# Altium schematic sheet Connectors.SchDoc
size B; DrawnBy: Ross Harvey; Revision: A; SheetNumber: 4; ModifiedDate: 7/2/2015; ProjectName: Atlas
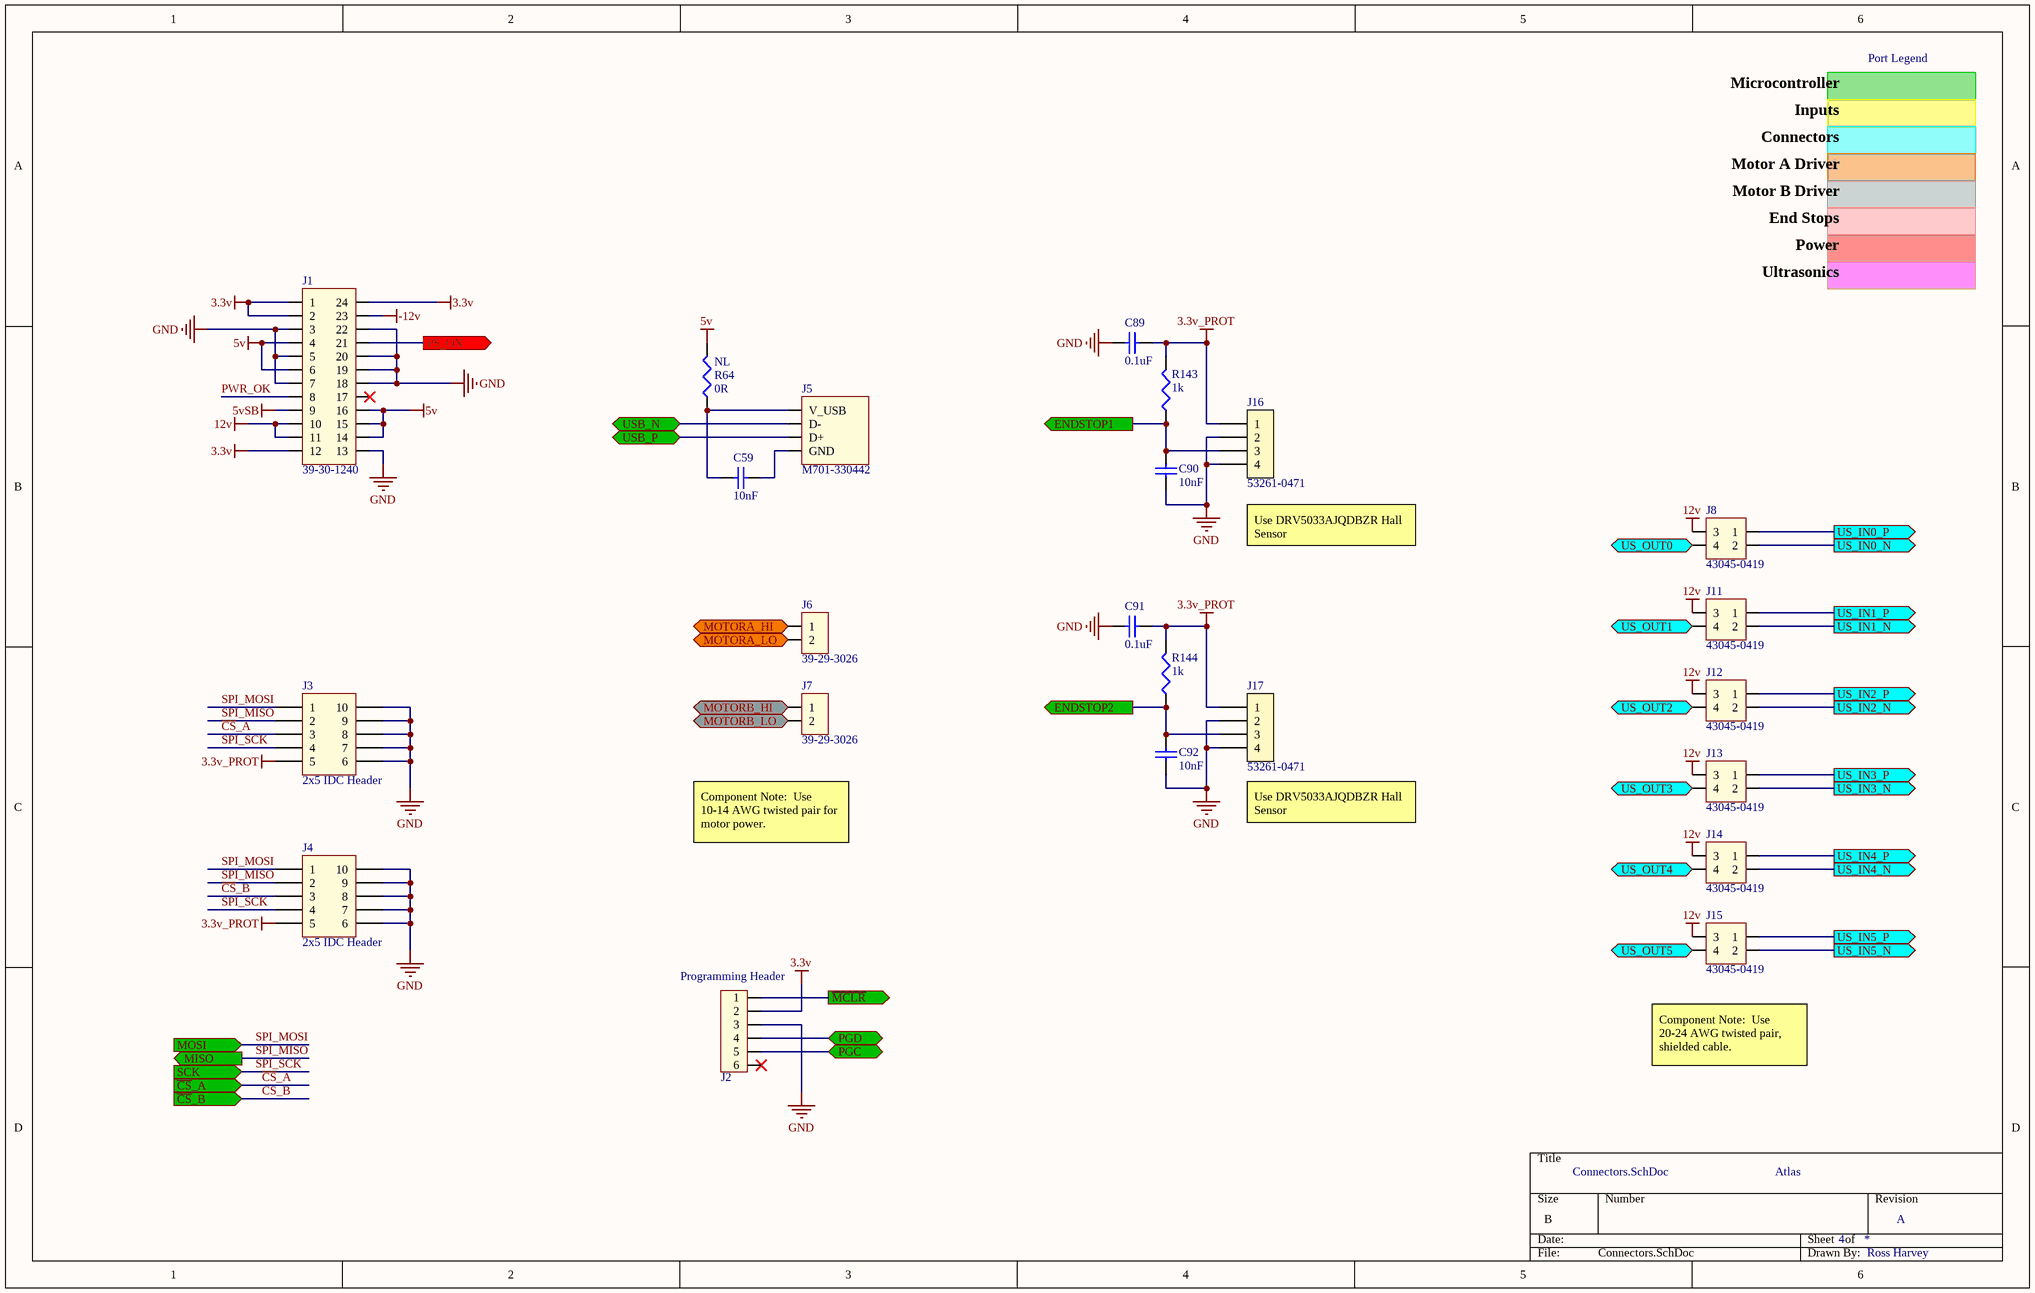
[diagram p0: Connectors.SchDoc]

## Parts
C59  10nF  [CAP0603W]
C89  0.1uF  [CAP0603W]
C90  10nF  [CAP0603W]
C91  0.1uF  [CAP0603W]
C92  10nF  [CAP0603W]
J1  39-30-1240  [MOLEX 39-30-1240]
J2  1x6 Header  [1x6 Header]  (value not drawn)
J3  87831-1010  [MOLEX_87831-1010]  (value not drawn)
J4  87831-1010  [MOLEX_87831-1010]  (value not drawn)
J5  M701-330442  [M701-330442]
J6  39-29-3026  [1x2 MicroFit]
J7  39-29-3026  [1x2 MicroFit]
J8  43045-0419  [MicroFit 2x2]
J11  43045-0419  [MicroFit 2x2]
J12  43045-0419  [MicroFit 2x2]
J13  43045-0419  [MicroFit 2x2]
J14  43045-0419  [MicroFit 2x2]
J15  43045-0419  [MicroFit 2x2]
J16  53261-0471  [1x4 PicoBlade]
J17  53261-0471  [1x4 PicoBlade]
R64  Load: NL  [RES0603W]  (hidden comment: 0R)
R143  1k  [RES0603W]
R144  1k  [RES0603W]

## Ports
ENDSTOP1 (out), ENDSTOP2 (out), MISO (out), MOSI (in), MOTORA_HI (bidir), MOTORA_LO (bidir), MOTORB_HI (bidir), MOTORB_LO (bidir), PGC (bidir), PGD (bidir), PS_ON (out), SCK (in), US_IN0_N (out), US_IN0_P (out), US_IN1_N (out), US_IN1_P (out), US_IN2_N (out), US_IN2_P (out), US_IN3_N (out), US_IN3_P (out), US_IN4_N (out), US_IN4_P (out), US_IN5_N (out), US_IN5_P (out), US_OUT0 (in), US_OUT1 (in), US_OUT2 (in), US_OUT3 (in), US_OUT4 (in), US_OUT5 (in), USB_N (bidir), USB_P (bidir), ~{CS}_A (in), ~{CS}_B (in), ~{MCLR} (out)

## Nets
3.3v: J1.1 J1.2 J1.12 J1.24 J2.2
3.3v_PROT: C89.1 C91.1 J3.5 J4.5 J16.1 J17.1 R143.2 R144.2
5v: J1.4 J1.6 J1.14 J1.15 J1.16 R64.2
5vSB: J1.9
12v: J1.10 J1.11 J8.3 J11.3 J12.3 J13.3 J14.3 J15.3
-12v: J1.23
GND: C89.2 C90.2 C91.2 C92.2 J1.3 J1.5 J1.7 J1.13 J1.18 J1.19 J1.20 J1.22 J2.3 J3.6 J3.7 J3.8 J3.9 J3.10 J4.6 J4.7 J4.8 J4.9 J4.10 J16.2 J16.4 J17.2 J17.4
~{CS}_A: J3.3 ; port ~{CS}_A
~{CS}_B: J4.3 ; port ~{CS}_B
ENDSTOP1: C90.1 J16.3 R143.1 ; port ENDSTOP1
ENDSTOP2: C92.1 J17.3 R144.1 ; port ENDSTOP2
~{MCLR}: J2.1 ; port ~{MCLR}
MOTORA_HI: J6.1 ; port MOTORA_HI
MOTORA_LO: J6.2 ; port MOTORA_LO
MOTORB_HI: J7.1 ; port MOTORB_HI
MOTORB_LO: J7.2 ; port MOTORB_LO
PGC: J2.5 ; port PGC
PGD: J2.4 ; port PGD
PS_ON: J1.21 ; port PS_ON
PWR_OK: J1.8
SPI_MISO: J3.2 J4.2 ; port MISO
SPI_MOSI: J3.1 J4.1 ; port MOSI
SPI_SCK: J3.4 J4.4 ; port SCK
US_IN0_N: J8.2 ; port US_IN0_N
US_IN0_P: J8.1 ; port US_IN0_P
US_IN1_N: J11.2 ; port US_IN1_N
US_IN1_P: J11.1 ; port US_IN1_P
US_IN2_N: J12.2 ; port US_IN2_N
US_IN2_P: J12.1 ; port US_IN2_P
US_IN3_N: J13.2 ; port US_IN3_N
US_IN3_P: J13.1 ; port US_IN3_P
US_IN4_N: J14.2 ; port US_IN4_N
US_IN4_P: J14.1 ; port US_IN4_P
US_IN5_N: J15.2 ; port US_IN5_N
US_IN5_P: J15.1 ; port US_IN5_P
US_OUT0: J8.4 ; port US_OUT0
US_OUT1: J11.4 ; port US_OUT1
US_OUT2: J12.4 ; port US_OUT2
US_OUT3: J13.4 ; port US_OUT3
US_OUT4: J14.4 ; port US_OUT4
US_OUT5: J15.4 ; port US_OUT5
USB_N: J5.2(D-) ; port USB_N
USB_P: J5.3(D+) ; port USB_P
NetC59_1: C59.1 J5.1(V_USB) R64.1
NetC59_2: C59.2 J5.4(GND)

Not connected (* = marked no-connect by the designer): J1 17*; J2 6*

## Notes on the sheet
- Microcontroller
- Port Legend
- Inputs
- Connectors
- Motor A Driver
- Motor B Driver
- End Stops
- Power
- Ultrasonics
- (near J16) Use DRV5033AJQDBZR Hall Sensor
- Component Note:  Use 10-14 AWG twisted pair for motor power.
- (near J17) Use DRV5033AJQDBZR Hall Sensor
- (near J2) Programming Header
- Component Note:  Use 20-24 AWG twisted pair, shielded cable.

## Library data of the parts
C59 C90 C92 = 10nF: MFG1_PN: VJ0603Y103KXAAC; MFG1: Vishay; Value: 10nF
C89 C91 = 0.1uF: MFG1_PN: VJ0603Y104JXJPW1BC; MFG1: Vishay; Value: 0.1uF
J1 = Molex_39-30-1240: Male Connector for ATX Power Supply; MFG: MOLEX; CURRENT: 13A; MFG_PN: 39-30-1240
J2 = 1x6 Header: 1x6 Header, 2.52mm pitch
J3 J4 = 2x5 IDC/Ribbon Header: 2x5 IDC Header; MFG: MOLEX; ROWS: 2; POSITIONS: 10; CURRENT: 2A; MATES_WITH: 87568-1063; MFG_PN: 87831-1010; TYPE: 2x5 IDC Header
J5 = USB Vertical Connector: Board Mounted Vertical USB B-Type Plug; MFG: HARWIN; CURRENT: 4A; MFG_PN: M701-330442
J6 J7 = 1x2 Microfit: MFG: MOLEX; CURRENT: 9A; MFG_PN: 39-29-3026; MATES_WITH_HOUSING: 39-01-2020; MATES_WITH_PIN: 39-00-0038
J8 J11-J15 = 2x2 Microfit: MFG: MOLEX; CURRENT: 5A; MATES_WITH_HOUSING: 43025-0400; MFG_PN: 43045-0419; MATES_WITH_PIN: 43025-0400
J16 J17 = 1x4 PicoBlade: 1x4 PicoBlade, 1.25mm Pitch, SMD; MFG: MOLEX; LOAD: NL; I_MAX: 1A; V_MAX: 125V; MATES_WITH_HOUSING: 51021-0400; MATES_WITH_PIN: 50079-8000; MFG_PN: 53261-0471
R64 = 0R (0603): MFG_PN: CRCW12060000Z0EA; MFG: Vishay; Value: 0R
R143 R144 = 1k (0603): Tolerance: 1%; POWER: 0.1W; MFG_PN: CRCW06031K00FKEA; MFG: Vishay; Load: NL; Value: 1k